# Altium schematic sheet P6_FilterMode.SchDoc
size 127 x 127 mm
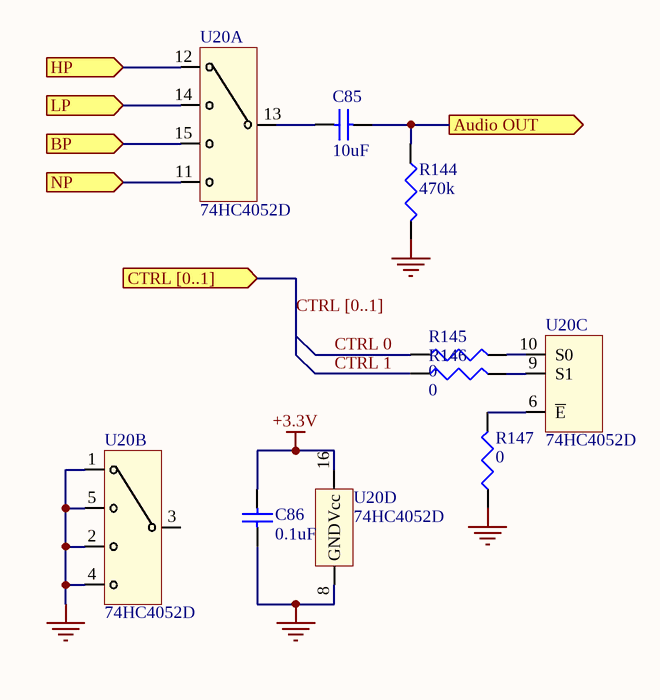
[diagram p0: P6_FilterMode.SchDoc]

## Parts
C85  10uF  [CAP 0603 (1608 metric)]
C86  0.1uF  [CAP 0603 (1608 metric)]
R144  470k  [RES 0603 (1608 metric)]
R145  0  [RES 0603 (1608 metric)]
R146  0  [RES 0603 (1608 metric)]
R147  0  [RES 0603 (1608 metric)]
U20  74HC4052D  (parts A,B,C,D of 4)

## Ports
Audio OUT (out), BP (in), CTRL [0..1] (in), HP (in), LP (in), NP (in)

## Nets
+3.3V: C86.1 U20.16(Vcc)
GND: C86.2 R144.2 R147.1 U20.1(2Y0) U20.2(2Y2) U20.4(2Y3) U20.5(2Y1) U20.8(GND)
Audio OUT: C85.1 R144.1 ; port Audio OUT
BP: U20.15(1Y2) ; port BP
CTRL 0: R145.1
CTRL 1: R146.1
HP: U20.12(1Y0) ; port HP
LP: U20.14(1Y1) ; port LP
NP: U20.11(1Y3) ; port NP
NetC85_2: C85.2 U20.13(1Z)
NetR145_2: R145.2 U20.10(S0)
NetR146_2: R146.2 U20.9(S1)
NetR147_2: R147.2 U20.6(~{E})

Not connected (* = marked no-connect by the designer): U20 3(2Z)

## Buses and harness runs
bus CTRL [0..1] = port CTRL [0..1]

## Library data of the parts
C85 C86 = Cap Semi: Capacitor (Semiconductor SIM Model)
  C85: Value: 10uF
  C86: Value: 0.1uF
R144-R147 = Res3: Resistor
  R144: Value: 470k
  R145-R147: Value: 0
U20 = 74HC4052D: Dual 4:1 Multiplexer